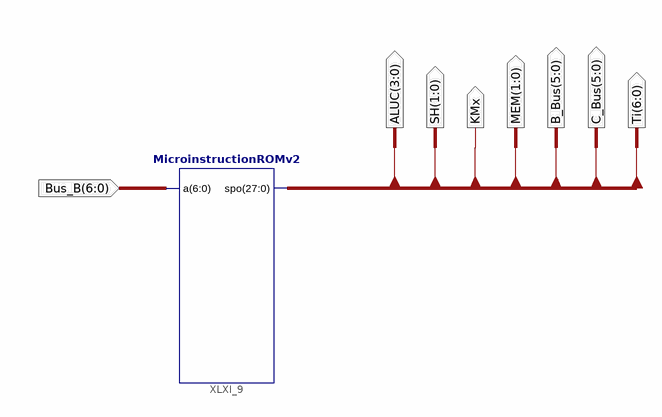
[diagram p0: schematic sheet 1]
// Xilinx ISE schematic MROM.sch (artix7) as structural Verilog: 1 symbols, 8 ports
module MROM (
  input  [6:0] Bus_B,
  output [6:0] Ti,
  output [5:0] C_Bus,
  output [5:0] B_Bus,
  output [1:0] MEM,
  output KMx,
  output [1:0] SH,
  output [3:0] ALUC
);

  MicroinstructionROMv2 XLXI_9 (.a(Bus_B), .spo({ALUC, SH, KMx, MEM, B_Bus, C_Bus, Ti}));
endmodule
